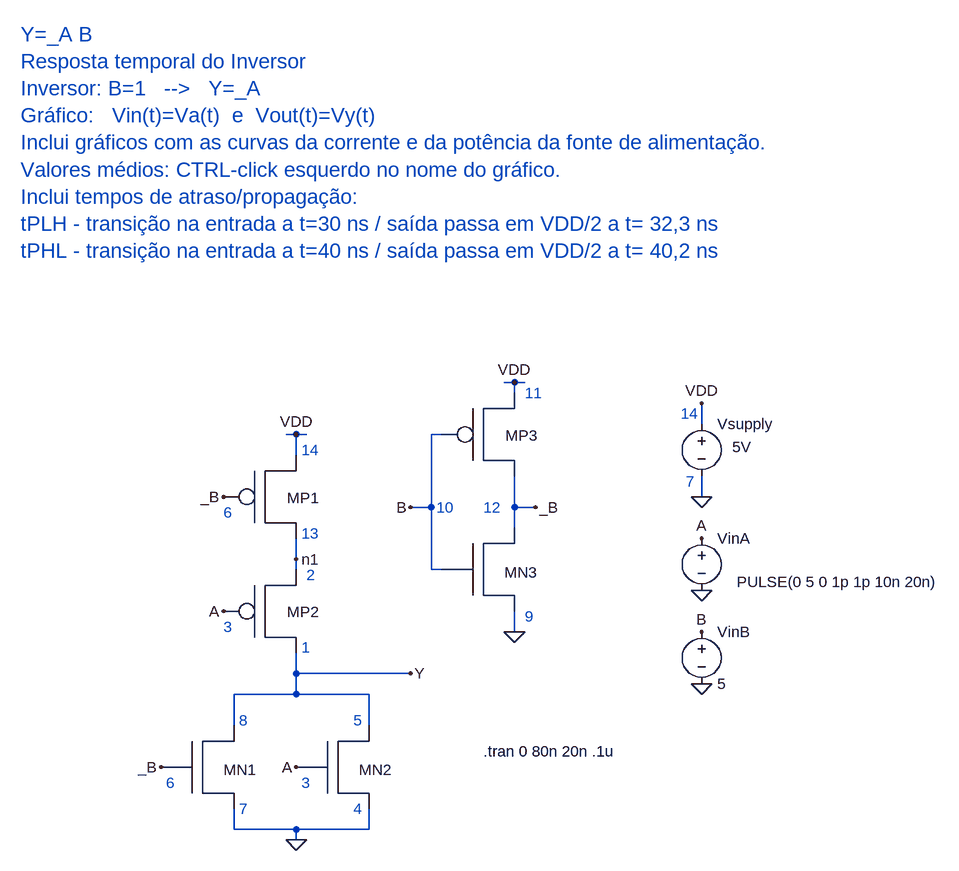
[diagram p0: schematic static-gate-inverter.asc]
static-gate-inverter.asc, the LTspice schematic file:
Version 4
SHEET 1 2472 680
WIRE 752 -80 736 -80
WIRE 768 -80 752 -80
WIRE 752 -64 752 -80
WIRE 1040 -16 1040 -48
WIRE 416 0 400 0
WIRE 432 0 416 0
WIRE 640 0 624 0
WIRE 416 32 416 0
WIRE 1040 96 1040 64
WIRE 624 112 624 0
WIRE 624 112 592 112
WIRE 752 112 752 64
WIRE 784 112 752 112
WIRE 752 144 752 112
WIRE 416 192 416 160
WIRE 416 208 416 192
WIRE 624 208 624 112
WIRE 640 208 624 208
WIRE 752 304 752 272
WIRE 416 368 416 336
WIRE 592 368 416 368
WIRE 416 400 416 368
WIRE 416 400 320 400
WIRE 528 400 416 400
WIRE 320 448 320 400
WIRE 528 448 528 400
WIRE 320 608 320 576
WIRE 416 608 320 608
WIRE 528 608 528 576
WIRE 528 608 416 608
WIRE 416 624 416 608
FLAG 1040 96 0
FLAG 1040 240 0
FLAG 1040 384 0
FLAG 1040 -48 VDD
FLAG 1040 160 A
FLAG 1040 304 B
FLAG 752 -80 VDD
FLAG 592 112 B
FLAG 784 112 _B
FLAG 416 0 VDD
FLAG 304 96 _B
FLAG 208 512 _B
FLAG 304 272 A
FLAG 416 512 A
FLAG 592 368 Y
FLAG 416 192 n1
FLAG 752 304 0
FLAG 416 624 0
SYMBOL voltage 1040 -32 R0
WINDOW 3 47 51 Left 2
SYMATTR Value 5V
SYMATTR InstName Vsupply
SYMBOL voltage 1040 144 R0
WINDOW 123 0 0 Left 2
WINDOW 39 0 0 Left 2
WINDOW 3 54 83 Left 2
SYMATTR InstName VinA
SYMATTR Value PULSE(0 5 0 1p 1p 10n 20n)
SYMBOL voltage 1040 288 R0
WINDOW 123 0 0 Left 2
WINDOW 39 0 0 Left 2
SYMATTR InstName VinB
SYMATTR Value 5
SYMBOL PMOSX 384 80 R0
SYMATTR InstName MP1
SYMBOL PMOSX 384 256 R0
SYMATTR InstName MP2
SYMBOL PMOSX 720 -16 R0
SYMATTR InstName MP3
SYMBOL NMOSX 288 496 R0
SYMATTR InstName MN1
SYMBOL NMOSX 496 496 R0
SYMATTR InstName MN2
SYMBOL NMOSX 720 192 R0
SYMATTR InstName MN3
TEXT 704 488 Left 2 !.tran 0 80n 20n .1u
TEXT 1008 -32 Left 2 ;14
TEXT 1016 72 Left 2 ;7
TEXT -8 -616 Left 3 ;Y=_A B\nResposta temporal do Inversor\nInversor: B=1   -->   Y=_A\nGráfico:   Vin(t)=Va(t)  e  Vout(t)=Vy(t)\nInclui gráficos com as curvas da corrente e da potência da fonte de alimentação.\nValores médios: CTRL-click esquerdo no nome do gráfico.\nInclui tempos de atraso/propagação:\ntPLH - transição na entrada a t=30 ns / saída passa em VDD/2 a t= 32,3 ns\ntPHL - transição na entrada a t=40 ns / saída passa em VDD/2 a t= 40,2 ns
TEXT 304 120 Left 2 ;6
TEXT 216 536 Left 2 ;6
TEXT 304 296 Left 2 ;3
TEXT 424 536 Left 2 ;3
TEXT 424 24 Left 2 ;14
TEXT 424 152 Left 2 ;13
TEXT 328 440 Left 2 ;8
TEXT 328 576 Left 2 ;7
TEXT 504 440 Left 2 ;5
TEXT 504 576 Left 2 ;4
TEXT 432 216 Left 2 ;2
TEXT 424 328 Left 2 ;1
TEXT 632 112 Left 2 ;10
TEXT 768 -64 Left 2 ;11
TEXT 704 112 Left 2 ;12
TEXT 768 280 Left 2 ;9

The netlist it stands for:
* static-gate-inverter.asc
Vsupply VDD 0 5V
VinA A 0 PULSE(0 5 0 1p 1p 10n 20n)
VinB B 0 5
XMP1 n1 _B VDD PMOSX  ; pins D G S
XMP2 Y A n1 PMOSX  ; pins D G S
XMP3 _B B VDD PMOSX  ; pins D G S
XMN1 Y _B 0 NMOSX  ; pins D G S
XMN2 Y A 0 NMOSX  ; pins D G S
XMN3 _B B 0 NMOSX  ; pins D G S
.tran 0 80n 20n .1u
* 14
* 7
* Y=_A B
* Resposta temporal do Inversor
* Inversor: B=1   -->   Y=_A
* Gráfico:   Vin(t)=Va(t)  e  Vout(t)=Vy(t)
* Inclui gráficos com as curvas da corrente e da potência da fonte de alimentação.
* Valores médios: CTRL-click esquerdo no nome do gráfico.
* Inclui tempos de atraso/propagação:
* tPLH - transição na entrada a t=30 ns / saída passa em VDD/2 a t= 32,3 ns
* tPHL - transição na entrada a t=40 ns / saída passa em VDD/2 a t= 40,2 ns
* 6
* 6
* 3
* 3
* 14
* 13
* 8
* 7
* 5
* 4
* 2
* 1
* 10
* 11
* 12
* 9
.lib MOS4007.txt
.backanno
.end